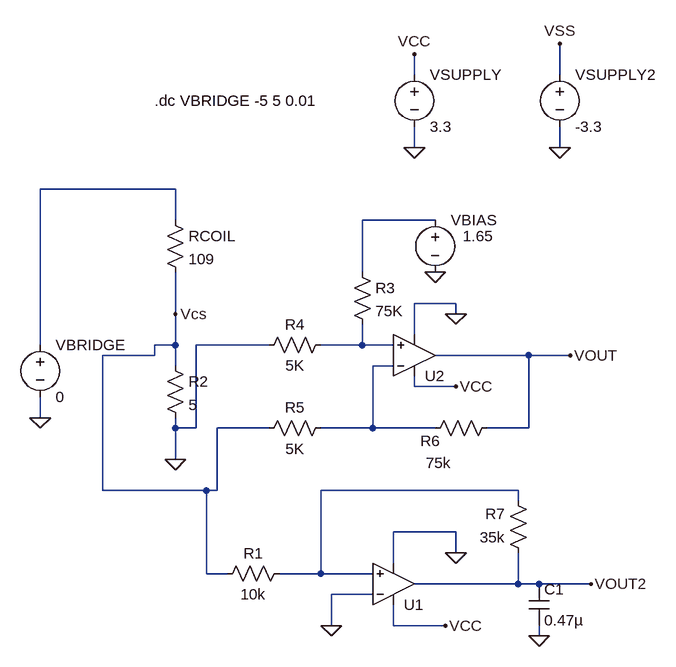
[diagram p0: schematic CURRENT_SENSE.asc]
CURRENT_SENSE.asc, the LTspice schematic file:
Version 4
SHEET 1 880 680
WIRE -256 -448 -256 -480
WIRE -32 -448 -32 -496
WIRE -256 -336 -256 -368
WIRE -32 -336 -32 -368
WIRE -624 -272 -832 -272
WIRE -624 -224 -624 -272
WIRE -224 -224 -336 -224
WIRE -336 -144 -336 -224
WIRE -192 -96 -256 -96
WIRE -624 -80 -624 -144
WIRE -192 -80 -192 -96
WIRE -256 -48 -256 -96
WIRE -832 -32 -832 -272
WIRE -624 -32 -624 -80
WIRE -624 -32 -656 -32
WIRE -480 -32 -592 -32
WIRE -336 -32 -336 -64
WIRE -336 -32 -400 -32
WIRE -288 -32 -336 -32
WIRE -656 -16 -656 -32
WIRE -656 -16 -736 -16
WIRE -80 -16 -224 -16
WIRE -16 -16 -80 -16
WIRE -624 0 -624 -32
WIRE -288 0 -320 0
WIRE -256 32 -256 16
WIRE -192 32 -256 32
WIRE -832 80 -832 48
WIRE -624 96 -624 80
WIRE -592 96 -592 -32
WIRE -592 96 -624 96
WIRE -480 96 -560 96
WIRE -320 96 -320 0
WIRE -320 96 -400 96
WIRE -224 96 -320 96
WIRE -80 96 -80 -16
WIRE -80 96 -144 96
WIRE -624 144 -624 96
WIRE -736 192 -736 -16
WIRE -576 192 -736 192
WIRE -560 192 -560 96
WIRE -560 192 -576 192
WIRE -96 192 -400 192
WIRE -96 208 -96 192
WIRE -192 256 -288 256
WIRE -192 288 -192 256
WIRE -288 304 -288 256
WIRE -576 320 -576 192
WIRE -544 320 -576 320
WIRE -400 320 -400 192
WIRE -400 320 -464 320
WIRE -320 320 -400 320
WIRE -96 336 -96 288
WIRE -96 336 -256 336
WIRE -64 336 -96 336
WIRE 16 336 -64 336
WIRE -320 352 -384 352
WIRE -384 400 -384 352
WIRE -288 400 -288 368
WIRE -208 400 -288 400
WIRE -64 416 -64 400
FLAG -256 -336 0
FLAG -192 -80 0
FLAG -192 32 VCC
FLAG -832 80 0
FLAG -256 -480 VCC
FLAG -624 144 0
FLAG -32 -496 VSS
FLAG -32 -336 0
FLAG -224 -144 0
FLAG -16 -16 VOUT
FLAG -624 -80 Vcs
FLAG -192 288 0
FLAG -208 400 VCC
FLAG -384 400 0
FLAG -64 416 0
FLAG 16 336 VOUT2
SYMBOL voltage -832 -48 R0
WINDOW 123 0 0 Left 0
WINDOW 39 0 0 Left 0
SYMATTR InstName VBRIDGE
SYMATTR Value 0
SYMBOL voltage -256 -464 R0
WINDOW 123 0 0 Left 0
WINDOW 39 0 0 Left 0
SYMATTR InstName VSUPPLY
SYMATTR Value 3.3
SYMBOL res -640 -240 R0
SYMATTR InstName RCOIL
SYMATTR Value 109
SYMBOL res -640 -16 R0
SYMATTR InstName R2
SYMATTR Value 5
SYMBOL res -352 -160 R0
SYMATTR InstName R3
SYMATTR Value 75K
SYMBOL res -384 -48 R90
WINDOW 0 0 56 VBottom 2
WINDOW 3 32 56 VTop 2
SYMATTR InstName R4
SYMATTR Value 5K
SYMBOL res -384 80 R90
WINDOW 0 0 56 VBottom 2
WINDOW 3 32 56 VTop 2
SYMATTR InstName R5
SYMATTR Value 5K
SYMBOL res -128 80 R90
WINDOW 0 51 103 VBottom 2
WINDOW 3 54 91 VTop 2
SYMATTR InstName R6
SYMATTR Value 75k
SYMBOL voltage -32 -464 R0
WINDOW 123 0 0 Left 0
WINDOW 39 0 0 Left 0
SYMATTR InstName VSUPPLY2
SYMATTR Value -3.3
SYMBOL voltage -224 -240 R0
WINDOW 3 43 40 Left 2
WINDOW 123 0 0 Left 0
WINDOW 39 0 0 Left 0
SYMATTR Value 1.65
SYMATTR InstName VBIAS
SYMBOL Opamps\\UniversalOpamp2 -256 -16 M180
SYMATTR InstName U2
SYMBOL Opamps\\UniversalOpamp2 -288 336 M180
SYMATTR InstName U1
SYMBOL res -448 304 R90
WINDOW 0 0 56 VBottom 2
WINDOW 3 32 56 VTop 2
SYMATTR InstName R1
SYMATTR Value 10k
SYMBOL res -80 304 R180
WINDOW 0 36 76 Left 2
WINDOW 3 36 40 Left 2
SYMATTR InstName R7
SYMATTR Value 35k
SYMBOL cap -80 336 R0
SYMATTR InstName C1
SYMATTR Value 0.47µ
TEXT -656 -408 Left 2 !.dc VBRIDGE -5 5 0.01

The netlist it stands for:
* CURRENT_SENSE.asc
VBRIDGE N001 0 0
VSUPPLY VCC 0 3.3
RCOIL N001 Vcs 109
R2 Vcs 0 5
R3 N002 N003 75K
R4 N003 0 5K
R5 N004 Vcs 5K
R6 VOUT N004 75k
VSUPPLY2 VSS 0 -3.3
VBIAS N002 0 1.65
XU2 N003 N004 VCC 0 VOUT level.2 Avol=1Meg GBW=10Meg Slew=10Meg ilimit=25m rail=0 Vos=0 phimargin=45 en=0 enk=0 in=0 ink=0 Rin=500Meg  ; pins IN+ IN- V+ V- OUT
XU1 N005 0 VCC 0 VOUT2 level.2 Avol=1Meg GBW=10Meg Slew=10Meg ilimit=25m rail=0 Vos=0 phimargin=45 en=0 enk=0 in=0 ink=0 Rin=500Meg  ; pins IN+ IN- V+ V- OUT
R1 N005 Vcs 10k
R7 VOUT2 N005 35k
C1 VOUT2 0 0.47µ
.dc VBRIDGE -5 5 0.01
.lib UniversalOpamps2.sub
.backanno
.end